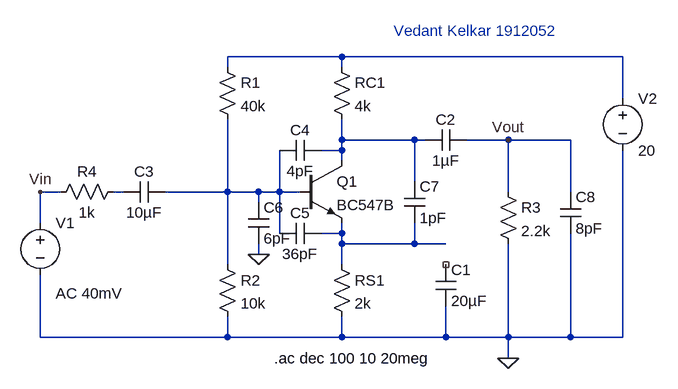
[diagram p0: schematic ECAD_exp1.asc]
ECAD_exp1.asc, the LTspice schematic file:
Version 4
SHEET 1 880 680
WIRE 64 -80 -112 -80
WIRE 496 -80 64 -80
WIRE -112 -64 -112 -80
WIRE 64 -64 64 -80
WIRE 496 -16 496 -80
WIRE 64 48 64 16
WIRE 176 48 64 48
WIRE 192 48 176 48
WIRE 320 48 256 48
WIRE 416 48 320 48
WIRE 64 64 64 48
WIRE 64 64 32 64
WIRE 64 80 64 64
WIRE 176 112 176 48
WIRE -368 128 -400 128
WIRE -272 128 -288 128
WIRE -112 128 -112 16
WIRE -112 128 -208 128
WIRE -64 128 -112 128
WIRE -32 128 -32 64
WIRE -32 128 -64 128
WIRE 0 128 -32 128
WIRE 320 128 320 48
WIRE 416 128 416 48
WIRE -64 144 -64 128
WIRE -400 176 -400 128
WIRE -32 192 -32 128
WIRE 64 192 64 176
WIRE 64 192 32 192
WIRE 64 208 64 192
WIRE 176 208 176 176
WIRE 176 208 64 208
WIRE 224 208 176 208
WIRE -64 224 -64 208
WIRE -112 240 -112 128
WIRE 64 240 64 208
WIRE -400 352 -400 256
WIRE -112 352 -112 320
WIRE -112 352 -400 352
WIRE 64 352 64 320
WIRE 64 352 -112 352
WIRE 224 352 224 304
WIRE 224 352 64 352
WIRE 320 352 320 208
WIRE 320 352 224 352
WIRE 416 352 416 192
WIRE 416 352 320 352
WIRE 496 352 496 64
WIRE 496 352 416 352
WIRE 320 384 320 352
FLAG -400 128 Vin
FLAG 320 48 Vout
FLAG 320 384 0
FLAG -64 224 0
SYMBOL npn 0 80 R0
SYMATTR InstName Q1
SYMATTR Value BC547B
SYMBOL res 48 -80 R0
SYMATTR InstName RC1
SYMATTR Value 4k
SYMBOL res -128 -80 R0
SYMATTR InstName R1
SYMATTR Value 40k
SYMBOL res -128 224 R0
SYMATTR InstName R2
SYMATTR Value 10k
SYMBOL res 48 224 R0
SYMATTR InstName RS1
SYMATTR Value 2k
SYMBOL res 304 112 R0
SYMATTR InstName R3
SYMATTR Value 2.2k
SYMBOL cap 208 240 R0
SYMATTR InstName C1
SYMATTR Value 20µF
SYMBOL cap 256 32 R90
WINDOW 0 0 32 VBottom 2
WINDOW 3 32 32 VTop 2
SYMATTR InstName C2
SYMATTR Value 1µF
SYMBOL cap -208 112 R90
WINDOW 0 0 32 VBottom 2
WINDOW 3 32 32 VTop 2
SYMATTR InstName C3
SYMATTR Value 10µF
SYMBOL voltage -400 160 R0
WINDOW 123 24 124 Left 2
WINDOW 39 0 0 Left 0
SYMATTR Value2 AC 40mV
SYMATTR InstName V1
SYMATTR Value ""
SYMBOL voltage 496 -32 R0
WINDOW 123 0 0 Left 0
WINDOW 39 0 0 Left 0
SYMATTR InstName V2
SYMATTR Value 20
SYMBOL res -272 112 R90
WINDOW 0 0 56 VBottom 2
WINDOW 3 32 56 VTop 2
SYMATTR InstName R4
SYMATTR Value 1k
SYMBOL cap 32 48 R90
WINDOW 0 0 32 VBottom 2
WINDOW 3 32 32 VTop 2
SYMATTR InstName C4
SYMATTR Value 4pF
SYMBOL cap 32 176 R90
WINDOW 0 0 32 VBottom 2
WINDOW 3 32 32 VTop 2
SYMATTR InstName C5
SYMATTR Value 36pF
SYMBOL cap -80 144 R0
SYMATTR InstName C6
SYMATTR Value 6pF
SYMBOL cap 160 112 R0
SYMATTR InstName C7
SYMATTR Value 1pF
SYMBOL cap 400 128 R0
SYMATTR InstName C8
SYMATTR Value 8pF
TEXT -40 384 Left 2 !.ac dec 100 10 20meg
TEXT 144 -120 Left 2 ;Vedant Kelkar 1912052

The netlist it stands for:
* ECAD_exp1.asc
Q1 N002 N004 N005 0 BC547B
RC1 N001 N002 4k
R1 N001 N004 40k
R2 N004 0 10k
RS1 N005 0 2k
R3 Vout 0 2.2k
C1 NC_01 0 20µF
C2 Vout N002 1µF
C3 N004 N003 10µF
V1 Vin 0 AC 40mV
V2 N001 0 20
R4 N003 Vin 1k
C4 N002 N004 4pF
C5 N005 N004 36pF
C6 N004 0 6pF
C7 N002 N005 1pF
C8 Vout 0 8pF
.model NPN NPN
.model PNP PNP
.lib standard.bjt
.ac dec 100 10 20meg
* Vedant Kelkar 1912052
.backanno
.end